# EAGLE schematic WaterPull (EAGLE 9.6.2)
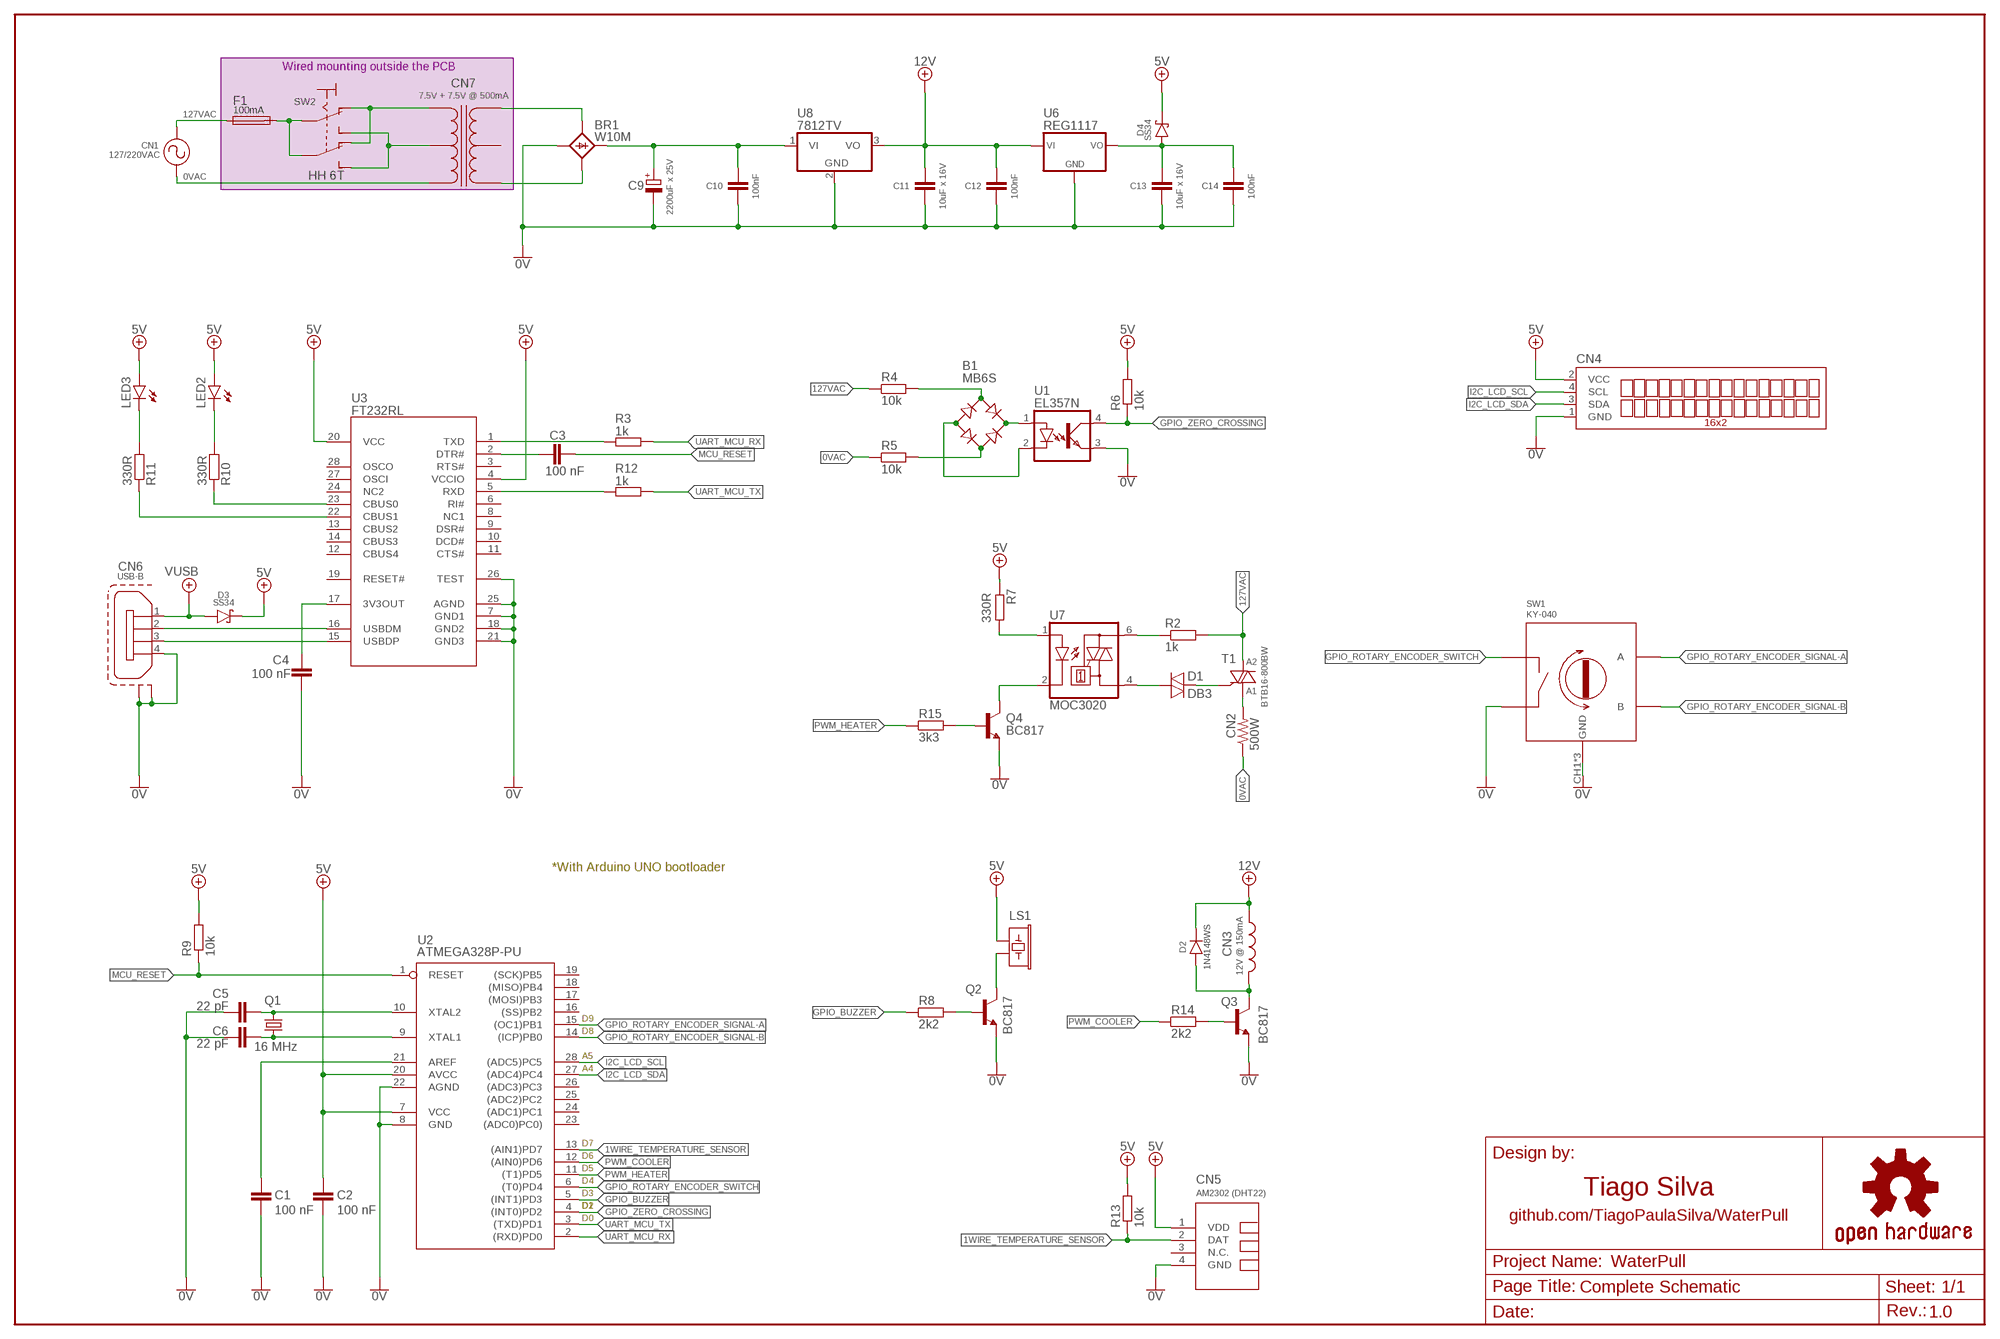
[diagram p0: schematic, sheet 1]

## Parts
B1  MB6S  MB1S  [SOIC-4]
BR1  W10M  [DIOB_W005M]
C1  100 nF  C_0805  [C0805]
C2  100 nF  C_0805  [C0805]
C3  100 nF  C_0805  [C0805]
C4  100 nF  C_0805  [C0805]
C5  22 pF  C_0805  [C0805]
C6  22 pF  C_0805  [C0805]
C9  2200uF x 25V  CPOL-EUE7.5-16  [E7,5-16]
C10  100nF  C_0805  [C0805]
C11  10uF x 16V  C_0805  [C0805]
C12  100nF  C_0805  [C0805]
C13  10uF x 16V  C_0805  [C0805]
C14  100nF  C_0805  [C0805]
CN1  127/220VAC  GENERATOR-FP  [AK500/2-H]
CN2  500W  R-US_KRE  [AK500/2-H]
CN3  12V @ 150mA  FAN-COOLER  [JST-PH2]
CN4  TUXGR_16X2_R2  [TUXGR_16X2_R2]
CN5  AM2302 (DHT22)  TEMP-HUM-SENSOR-DHT22  [TEMP-HUM-SENSOR-DHT22]
CN6  USB-B  [USB-B]
CN7  7.5V + 7.5V @ 500mA  TRAFO3  [3PINS]
D1  DB3  DIAC-DO35-10  [DO35-10]
D2  1N4148WS  [SOD323F]
D3  SS34  [DO214AB]
D4  SS34  [DO214AB]
F1  100mA  FUSE  (no package)
LED2  LEDCHIPLED_0805  [CHIPLED_0805]
LED3  LEDCHIPLED_0805  [CHIPLED_0805]
LS1  BUZZER-PTH  [BUZZER-12MM]
Q1  16 MHz  CRYSTALHC49S  [HC49/S]
Q2  BC817  BC817-16-NPN-SOT23-BEC  [SOT23-BEC]
Q3  BC817  BC817-16-NPN-SOT23-BEC  [SOT23-BEC]
Q4  BC817  BC817-16-NPN-SOT23-BEC  [SOT23-BEC]
R2  1k  R-EU_0207/7  [0207/7]
R3  1k  R_0805  [R0805]
R4  10k  R-EU_0207/7  [0207/7]
R5  10k  R-EU_0207/7  [0207/7]
R6  10k  R_0805  [R0805]
R7  330R  R_0805  [R0805]
R8  2k2  R_0805  [R0805]
R9  10k  R_0805  [R0805]
R10  330R  R_0805  [R0805]
R11  330R  R_0805  [R0805]
R12  1k  R_0805  [R0805]
R13  10k  R-EU_R0805  [R0805]
R14  2k2  R_0805  [R0805]
R15  3k3  R_0805  [R0805]
SW1  KY-040  [KY-040]
SW2  HH 6T  320-938  (no package)
T1  BTB16-800BW  BT138-H  [TO220BH]
U1  EL357N  EL357N(A)(TA)-G  [SOP254P700X200-4N]
U2  ATMEGA328P-PU  [DIL28-3]
U3  FT232RL  [SSOP28]
U6  REG1117  [SOT223]
U7  MOC3020  MOC3010M  [DIL06]
U8  7812TV  [TO220V]

## Nets
0V: BR1.- C1.2 C2.2 C4.1 C5.1 C6.1 C9.- C10.2 C11.2 C12.2 C13.2 C14.2 CN4.1(GND) CN5.4(GND) CN6.4 CN6.M1(S1) CN6.M2(S2) Q2.E Q3.E Q4.E SW1.CH1(GND) SW1.CH2(GND) SW1.GND SW1.SW2 U1.3(E) U2.8(GND) U2.22(AGND) U3.7(GND1) U3.18(GND2) U3.21(GND3) U3.25(AGND) U3.26(TEST) U6.1(GND) U8.2(GND)
0VAC: CN1.1 CN2.1 R5.1
1WIRE_TEMPERATURE_SENSOR: CN5.2(DAT) R13.1 U2.13((AIN1)PD7)
5V: C2.1 CN4.2(VCC) CN5.1(VDD) D3.C(K) D4.C(K) LED2.A LED3.A LS1.+ R6.2 R7.1 R9.2 R13.2 U2.7(VCC) U2.20(AVCC) U3.4(VCCIO) U3.20(VCC)
12VDC: C11.1 C12.1 CN3.2 D2.C(K) U6.3(VIN) U8.3(VO) ; supply symbol labelled 12V
127VAC: CN1.2 F1.1 R2.2 R4.1 T1.T2(A2)
A1: CN2.2 T1.T1(A1)
AREF: C1.1 U2.21(AREF)
GND1: BR1.~B(AC2) CN7.3
GPIO_BUZZER: R8.1 U2.5((INT1)PD3)
GPIO_ROTARY_ENCODER_SIGNAL-A: SW1.A U2.15((OC1)PB1)
GPIO_ROTARY_ENCODER_SIGNAL-B: SW1.B U2.14((ICP)PB0)
GPIO_ROTARY_ENCODER_SWITCH: SW1.SW1 U2.6((T0)PD4)
GPIO_ZERO_CROSSING: R6.1 U1.4(C) U2.4((INT0)PD2)
I2C_LCD_SCL: CN4.4(SCL) U2.28((ADC5)PC5)
I2C_LCD_SDA: CN4.3(SDA) U2.27((ADC4)PC4)
MCU_RESET: C3.1 R9.1 U2.1(RESET)
N$1: D1.A U7.4(A1)
N$2: D1.C T1.G
N$3: B1.~1(AC1) R4.2
N$4: B1.~2(AC2) R5.2
N$5: B1.+ U1.1(A)
N$6: B1.- U1.2(K)
N$7: R3.2 U3.1(TXD)
N$8: F1.2 SW2.P
N$9: R2.1 U7.6(A2)
N$10: R7.2 U7.1(A)
N$11: LS1.- Q2.C
N$12: R12.2 U3.5(RXD)
N$13: BR1.+ C9.+ C10.1 U8.1(VI)
N$14: Q4.B R15.2
N$15: Q4.C U7.2(C)
N$16: C13.1 C14.1 D4.A U6.2(VOUT) U6.4(VOUT)
N$24: C3.2 U3.2(DTR#)
N$25: R10.1 U3.23(CBUS0)
N$26: LED2.C R10.2
N$28: LED3.C R11.2
N$29: C5.2 Q1.2 U2.10(XTAL2)
N$30: C6.2 Q1.1 U2.9(XTAL1)
N$31: R11.1 U3.22(CBUS1)
N$32: C4.2 U3.17(3V3OUT)
N$33: CN6.2 U3.16(USBDM)
N$34: CN6.3 U3.15(USBDP)
N$35: Q2.B R8.2
N$36: SW2.S
N$37: CN3.1 D2.A Q3.C
N$39: Q3.B R14.2
N$41: SW2.O
N$42: BR1.~A(AC1) CN7.1
PWM_COOLER: R14.1 U2.12((AIN0)PD6)
PWM_HEATER: R15.1 U2.11((T1)PD5)
UART_MCU_RX: R3.1 U2.2((RXD)PD0)
UART_MCU_TX: R12.1 U2.3((TXD)PD1)
VUSB: CN6.1 D3.A
Unconnected: CN5.3(N.C.) CN7.2 U2.16((SS)PB2) U2.17((MOSI)PB3) U2.18((MISO)PB4) U2.19((SCK)PB5) U2.23((ADC0)PC0)) U2.24((ADC1)PC1) U2.25((ADC2)PC2) U2.26((ADC3)PC3) U3.3(RTS#) U3.6(RI#) U3.8(NC1) U3.9(DSR#) U3.10(DCD#) U3.11(CTS#) U3.12(CBUS4) U3.13(CBUS2) U3.14(CBUS3) U3.19(RESET#) U3.24(NC2) U3.27(OSCI) U3.28(OSCO)

## Notes on the sheet
- Wired mounting outside the PCB
- A2
- A1
- *With Arduino UNO bootloader
- D9
- D8
- A5
- A4
- D7
- D6
- D5
- D4 | Tiago Silva
- D3
- D1 | D2
- github.com/TiagoPaulaSilva/WaterPull
- D0
- Complete Schematic
- 1.0

## Library data of the parts
B1 = rectifier:MB*S: Bridge Rectifier Source: http://www.fairchildsemi.com/ds/MB/MB6S.pdf
BR1 = My-Rectifiers:W10M
C1-C6 C10-C14 = My-RLC:C_: NON-POLARIZED CAP
C9 = rcl:CPOL-EU: POLARIZED CAPACITOR, European symbol; SPICEPREFIX: C
CN1 = Instrumentos:GENERATOR-FP
CN2 = rcl:R-US_: RESISTOR, American symbol
CN3 = My-Electromechanicals:FAN-COOLER
CN4 = LCD 16X2 i2c:TUXGR_16X2_R2: Tuxgraphics LCD display 16x2 characters reflective, without background light Source: tuxgr_12x2_r2.pdf; OC_FARNELL: unknown; OC_NEWARK: unknown
CN5 = diy-modules:TEMP-HUM-SENSOR-DHT22: DHT22 - digital humidity & temperature sensor Also known as: AM2302 AM2302 datasheet available here: http://akizukidenshi.com/download/ds/aosong/AM2302.pdf Click here to find device on ebay.com <http://www.ebay.com/sch/dht22+digital+sensor>
CN6 = My-Connectors:USB-B
CN7 = My-Transformers:TRAFO3
D1 = diode:DIAC-: DIAC
D2 = My-Diodes:1N4148WS
D3 D4 = My-Diodes:SS34
F1 = fuse-no-footprint:FUSE: Fuse; _EXTERNAL_: _EXTERNAL_
LED2 LED3 = led:LED: LED OSRAM: - CHIPLED LG R971, LG N971, LY N971, LG Q971, LY Q971, LO R971, LY R971 LH N974, LH R974 LS Q976, LO Q976, LY Q976 LO Q996 - Hyper CHIPLED LW Q18S LB Q993, LB Q99A, LB R99A - SideLED LS A670, LO A670, LY A670, LG A670, LP A670 LB A673, LV A673, LT A673, LW A673 LH A674 LY A675 LS A676, LA A676, LO A676, LY A676, LW A676 LS A679, LY A679, LG A679 - Hyper Micro SIDELED® LS Y876, LA Y876, LO Y876, LY Y876 LT Y87S - SmartLED LW L88C, LW L88S LB L89C, LB L89S, LG L890 LS L89K, LO L89K, LY L89K LS L896, LA L896, LO L896, LY L896 - TOPLED LS T670, LO T670, LY T670, LG T670, LP T670 LSG T670, LSP T670, LSY T670, LOP T670, LYG T670 LG T671, LOG T671, LSG T671 LB T673, LV T673, LT T673, LW T673 LH T674 LS T676, LA T676, LO T676, LY T676, LB T676, LH T676, LSB T676, LW T676 LB T67C, LV T67C, LT T67C, LS T67K, LO T67K, LY T67K, LW E67C LS E67B, LA E67B, LO E67B, LY E67B, LB E67C, LV E67C, LT E67C LW T67C LS T679, LY T679, LG T679 LS T770, LO T770, LY T770, LG T770, LP T770 LB T773, LV T773, LT T773, LW T773 LH T774 LS E675, LA E675, LY E675, LS T675 LS T776, LA T776, LO T776, LY T776, LB T776 LHGB T686 LT T68C, LB T68C - Hyper Mini TOPLED® LB M676 - Mini TOPLED Santana® LG M470 LS M47K, LO M47K, LY M47K Source: http://www.osram.convergy.de LUXEON: - LUMILED® LXK2-PW12-R00, LXK2-PW12-S00, LXK2-PW14-U00, LXK2-PW14-V00 LXK2-PM12-R00, LXK2-PM12-S00, LXK2-PM14-U00 LXK2-PE12-Q00, LXK2-PE12-R00, LXK2-PE12-S00, LXK2-PE14-T00, LXK2-PE14-U00 LXK2-PB12-K00, LXK2-PB12-L00, LXK2-PB12-M00, LXK2-PB14-N00, LXK2-PB14-P00, LXK2-PB14-Q00 LXK2-PR12-L00, LXK2-PR12-M00, LXK2-PR14-Q00, LXK2-PR14-R00 LXK2-PD12-Q00, LXK2-PD12-R00, LXK2-PD12-S00 LXK2-PH12-R00, LXK2-PH12-S00 LXK2-PL12-P00, LXK2-PL12-Q00, LXK2-PL12-R00 Source: www.luxeon.com KINGBRIGHT: KA-3528ASYC Source: www.kingbright.com
LS1 = SparkFun-Electromechanical:BUZZER: Buzzer Small round buzzers that operate around the audible 2kHz range. You can use these as speakers to create simple music or user interfaces. Variant Overview: PTH - Mini Speaker - PC Mount 12mm 2.048kHz <https://www.sparkfun.com/products/7950> PTH_KIT - Mini Speaker - PC Mount 12mm 2.048kHz <https://www.sparkfun.com/products/7950> KIT simplifies soldering by adding stop mask to one side of the pads. PTH_NO_SILK - Mini Speaker - PC Mount 12mm 2.048kHz <https://www.sparkfun.com/products/7950> No silkscreen indicator of buzzer outline. PTH_KIT_NO_SILK - Mini Speaker - PC Mount 12mm 2.048kHz <https://www.sparkfun.com/products/7950> KIT package w/o silkscreen SMD - Buzzer Audio Magnetic (CCV-084B16) SMD buzzer used on, e.g. the LilyPad Buzzer <https://www.sparkfun.com/products/8463> and RFID USB Reader <https://www.sparkfun.com/products/9963>. SMD_KIT - Buzzer Audio Magnetic (CCV-084B16) SMD Buzzer with elongated pins to make soldering easier. Used on the SparkFun Simon Says - Surface Mount Soldering Kit <https://www.sparkfun.com/products/10935>.; PROD_ID: COMP-08253; SF_SKU: COM-07950
Q1 = crystal:CRYSTAL: CRYSTAL; OC_FARNELL: 1667008; OC_NEWARK: unknown
Q2-Q4 = transistor:*-NPN-: NPN Transistror BF959 corrected 2008.03.06
R2 R4 R5 R13 = rcl:R-EU_: RESISTOR, European symbol; SPICEPREFIX: R
R3 R6-R12 R14 R15 = My-RLC:R_: RESISTOR
SW1 = rotary-encoder:KY-040
SW2 = switch-HH-NO-MODEL:320-938: TOGGLE SWITCH distributor RS Components; _EXTERNAL_: _EXTERNAL_
T1 = triac:BT138: TRIAC Source: http://www.semiconductors.philips.com BT138_SERIES_2.pdf
U1 = EL357N:EL357N(A)(TA)-G: Optocoupler [Everlight Electronics] EL357N(A)(TA)-G Optocoupler Check prices <https://pricing.snapeda.com/parts/EL357N%28A%29%28TA%29-G/Everlight%20Electronics/view-part?ref=eda>; AVAILABILITY: Bad; DESCRIPTION: Optoisolator Transistor Output 3750Vrms 1 Channel 4-SOP (2.54mm); MF: Everlight Electronics; MP: EL357N(A)(TA)-G; PACKAGE: SOP-4 Everlight; PRICE: None
U2 = SmartPrj:ATMEGA328P-: MICROCONTROLLER 4 Kbytes FLASH 128 bytes SRAM 256 bytes EEPROM UART 6-channel 10 bit ADC
U3 = MySMD2:FT232RL
U6 = REG1117:REG1117: 800mA and 1A Low Dropout (LDO) Positive Regulator 1.8V, 2.5V, 2.85V, 3.3V, 5V, and Adj; AVAILABILITY: Unavailable; DESCRIPTION: LDO Regulator Pos 1.25V to 13.5V 0.8A 4-Pin_3+Tab_ SOT-223 Tube; MF: Texas Instruments; MP: REG1117; PACKAGE: SOT-223-4 Texas Instruments; PRICE: None
U7 = optocoupler:MOC30*M: RANDOM-PHASE OPTOISOLATORS TRIAC DRIVER OUTPUT Source: http://www.fairchildsemi.com MOC3020-M.pdf; MF: FAIRCHILD SEMICONDUCTOR; MPN: MOC3010-M; OC_FARNELL: 1505423; OC_NEWARK: 72K8892
U8 = linear:78*: Positive VOLTAGE REGULATOR Source: http://cache.national.com/ds/LM/LM78L05.pdf http://www.fairchildsemi.com/ds/LM/LM7805.pdf

## Net classes
2 gnd: width 0.305 mm, drill 0.559 mm, clearance 0.254 mm